# Altium schematic sheet PP.SchDoc
size A4
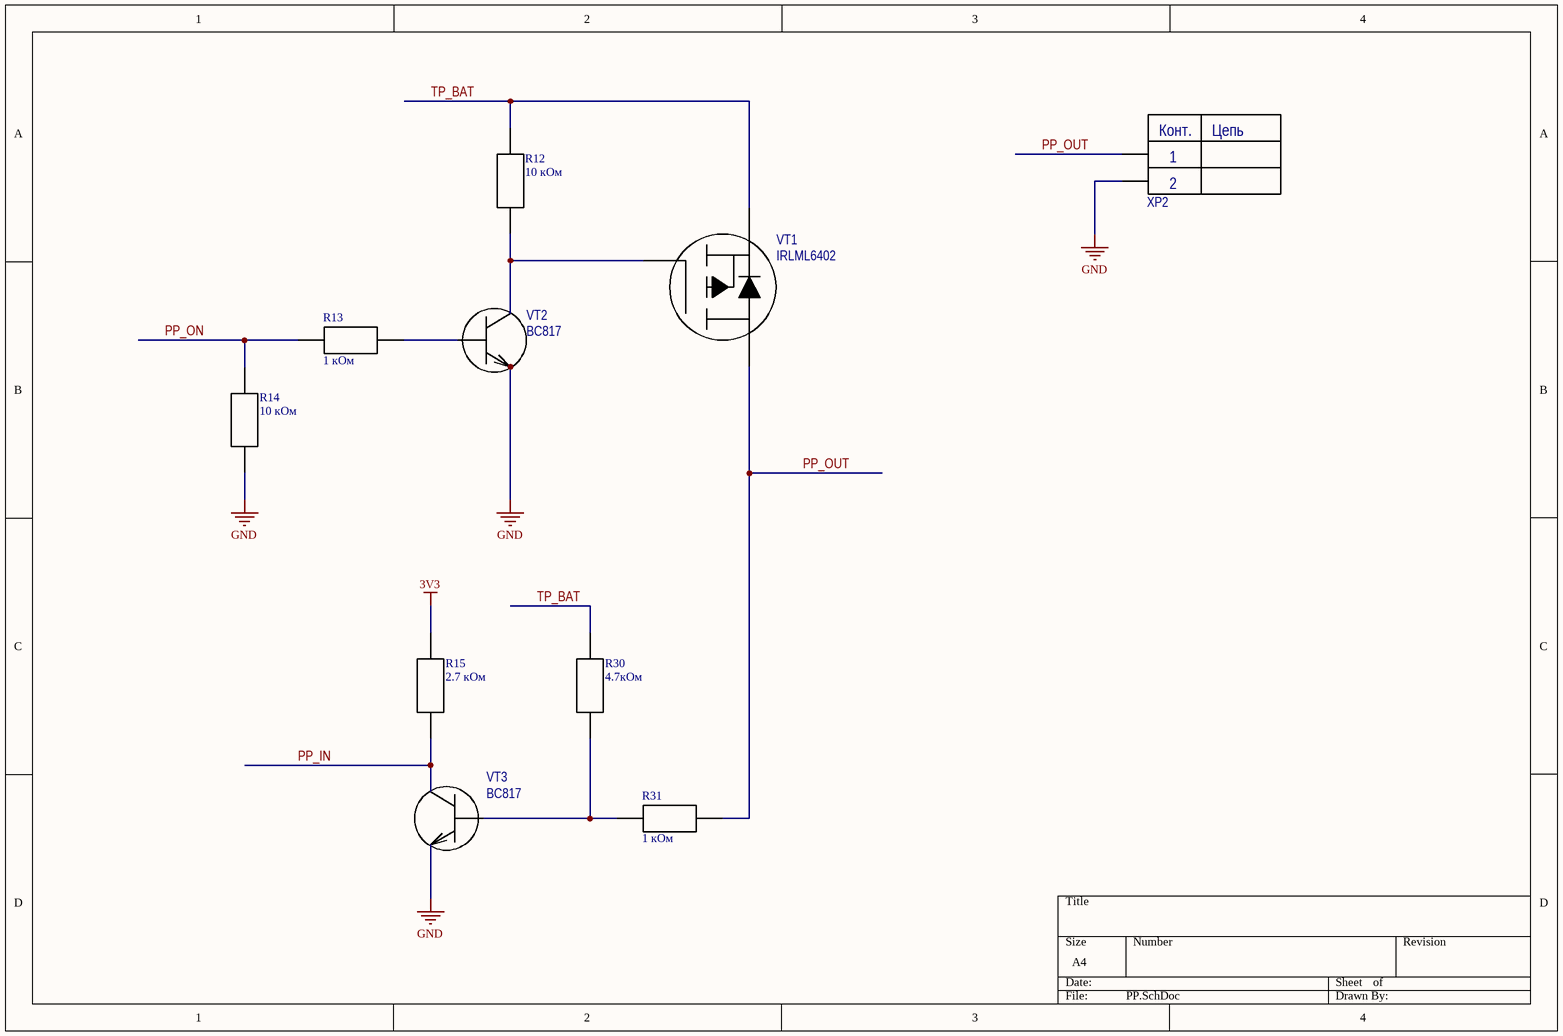
[diagram p0: PP.SchDoc]

## Parts
R12  10 кОм  [RES 0805]
R13  1 кОм  [RES 0805]
R14  10 кОм  [RES 0805]
R15  2.7 кОм  [RES 0805]
R30  4.7кОм  [RES 0805]
R31  1 кОм  [RES 0805]
VT1  IRLML6402  [SOT-23]
VT2  BC817  [SOT-23]
VT3  BC817  [SOT-23]
XP2  PLS-2  [PLS-2]  (value not drawn)

## Nets
3V3: R15.1
GND: R14.2 VT2.2(E) VT3.2(E) XP2.2
PP_IN: R15.2 VT3.3(C)
PP_ON: R13.2 R14.1
PP_OUT: R31.2 VT1.3(D) XP2.1
TP_BAT: R12.1 R30.1 VT1.2(S)
NetR12_2: R12.2 VT1.1(G) VT2.3(C)
NetR13_1: R13.1 VT2.1(B)
NetR30_2: R30.2 R31.1 VT3.1(B)

## Notes on the sheet
- (in symbol PLS-2) Конт.; Цепь

## Library data of the parts
R12-R15 R30 R31 = RES 0805
VT2 VT3 = BC817: NPN general-purpose transistor; Manufacturer: NXP; Structure: n-p-n; Type: Транзистор биполярный; hFE: 160 ... 600; Max collector-emitter voltage: 45 В; Max collector-base voltage: 50 В; Max emitter-base voltage: 5 В; Max collector current: 0,5 А; Max collector peak current: 1 А; Power dissitipation: 0,25 Вт; fT: 100 МГц; Collector-emitter saturation voltage: 0,7 В; Base-emitter on voltage: 1,2 В; Specitication: ЭКБ ИП; Collector-base сapacitance: 3 пФ; Complement: BC807; Temperature range: -65 ... 150 °C
XP2 = PLS-2: PLS connector; Manufacturer: NONAME; Connector type: Вилка на плату; Number of contacts: 2; Type: Разъем штыревой